# EAGLE design StmPulse-V1-G498043 (EAGLE 9.5.2)

## Sheet 1 of 6: Processor
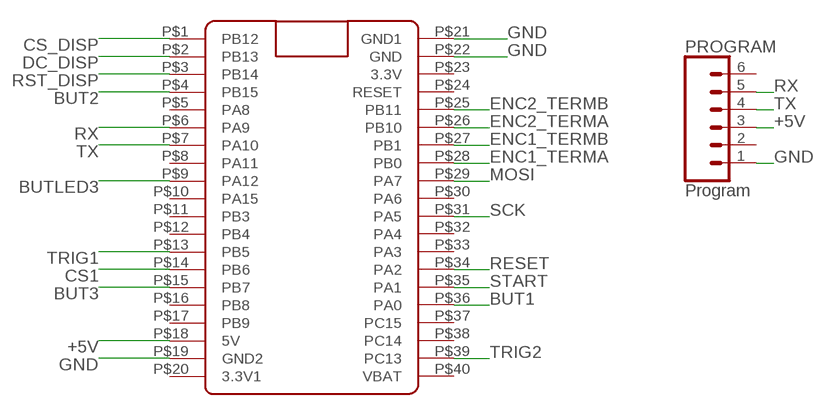
[diagram p0: schematic, sheet 1]

### Parts
PROGRAM  Program  CONN_06SILK_FEMALE_PTH  [1X06]
U$1  Blue Pill  BLUE_PILL  [BLUE_PILL]

### Nets
+5V: PROGRAM.3 U$1.P$18(5V) ; also sheet 2,3,4,5,6
BUT1 [Power]: U$1.P$36(PA0) ; also sheet 2
BUT2 [Power]: U$1.P$4(PB15) ; also sheet 2
BUT3: U$1.P$15(PB7) ; also sheet 2
BUTLED3: U$1.P$9(PA12) ; also sheet 2
CS1: U$1.P$14(PB6) ; also sheet 6
CS_DISP: U$1.P$1(PB12) ; also sheet 3,4
DC_DISP: U$1.P$2(PB13) ; also sheet 3,4
ENC1_TERMA: U$1.P$28(PB0) ; also sheet 2
ENC1_TERMB: U$1.P$27(PB1) ; also sheet 2
ENC2_TERMA: U$1.P$26(PB10) ; also sheet 2
ENC2_TERMB: U$1.P$25(PB11) ; also sheet 2
GND [Power]: PROGRAM.1 U$1.P$19(GND2) U$1.P$21(GND1) U$1.P$22(GND) ; also sheet 2,3,4,5,6
MOSI: U$1.P$29(PA7) ; also sheet 3,4,6
RESET: U$1.P$34(PA2) ; also sheet 2
RST_DISP: U$1.P$3(PB14) ; also sheet 3,4
RX: PROGRAM.5 U$1.P$6(PA9)
SCK: U$1.P$31(PA5) ; also sheet 3,4,6
START: U$1.P$35(PA1) ; also sheet 2
TRIG1: U$1.P$13(PB5) ; also sheet 5
TRIG2: U$1.P$39(PC13) ; also sheet 5
TX: PROGRAM.4 U$1.P$7(PA10)
Unconnected: PROGRAM.2 PROGRAM.6 U$1.P$5(PA8) U$1.P$8(PA11) U$1.P$10(PA15) U$1.P$11(PB3) U$1.P$12(PB4) U$1.P$16(PB8) U$1.P$17(PB9) U$1.P$20(3.3V1) U$1.P$23(3.3V) U$1.P$24(RESET) U$1.P$30(PA6) U$1.P$32(PA4) U$1.P$33(PA3) U$1.P$37(PC15) U$1.P$38(PC14) U$1.P$40(VBAT)

## Sheet 2 of 6: IO
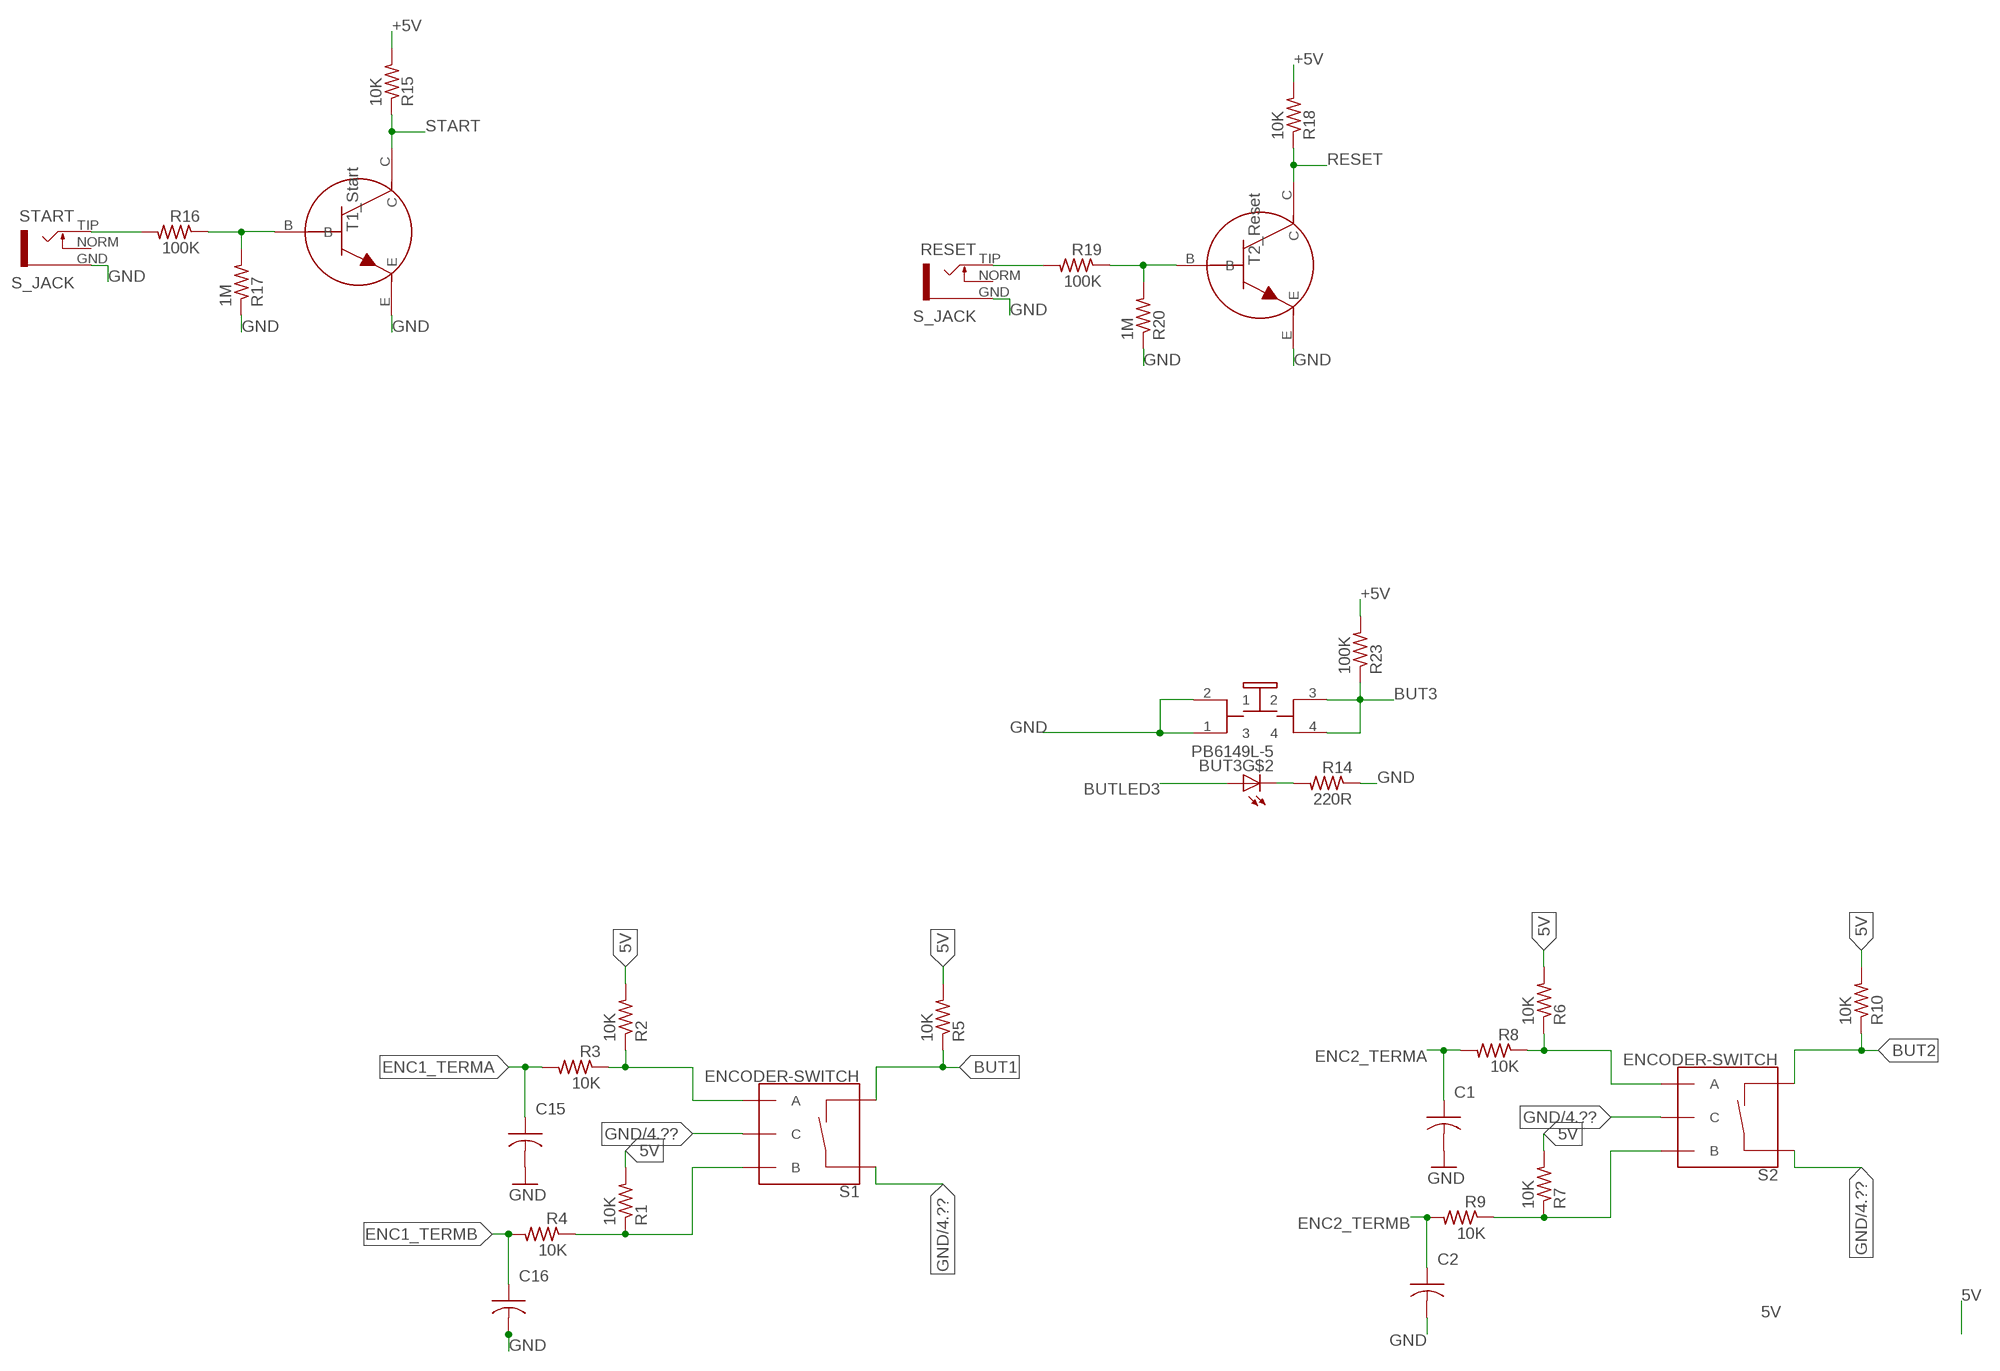
[diagram p1: schematic, sheet 2]

### Parts
BUT3  PB6149L-5  [PB6149L]
C1  10nF  C-USC0805  [C0805]
C2  10nF  C-USC0805  [C0805]
C15  10nF  C-USC0805  [C0805]
C16  10nF  C-USC0805  [C0805]
R1  10K  R-US_R0805  [R0805]
R2  10K  R-US_R0805  [R0805]
R3  10K  R-US_R0805  [R0805]
R4  10K  R-US_R0805  [R0805]
R5  10K  R-US_R0805  [R0805]
R6  10K  R-US_R0805  [R0805]
R7  10K  R-US_R0805  [R0805]
R8  10K  R-US_R0805  [R0805]
R9  10K  R-US_R0805  [R0805]
R10  10K  R-US_R0805  [R0805]
R14  220R  R-US_R0805  [R0805]
R15  10K  R-US_R0805  [R0805]
R16  100K  R-US_R0805  [R0805]
R17  1M  R-US_R0805  [R0805]
R18  10K  R-US_R0805  [R0805]
R19  100K  R-US_R0805  [R0805]
R20  1M  R-US_R0805  [R0805]
R23  100K  R-US_R0805  [R0805]
RESET  S_JACK  [S_JACK]
S1  ENCODER-SWITCH  [ROTARY_ENC_PLAIN]
S2  ENCODER-SWITCH  [ROTARY_ENC_PLAIN]
START  S_JACK  [S_JACK]
T1_CLOCK  2N3904  TRANSISTOR_MMBT3904  [TRANSISTOR_SINGLE_N-TYPE]
T2_RESET  TRANSISTOR_MMBT3904  [TRANSISTOR_SINGLE_N-TYPE]

### Nets
5V: R1.2 R2.2 R5.2 R6.2 R7.2 R10.2
+5V: R15.2 R18.2 R23.2 ; also sheet 1,3,4,5,6
BUT1 [Power]: R5.1 S1.SW- ; also sheet 1
BUT2 [Power]: R10.1 S2.SW- ; also sheet 1
BUT3: BUT3.3 BUT3.4 R23.1 ; also sheet 1
BUTLED3: BUT3.A ; also sheet 1
ENC1_TERMA: C15.1 R3.2 ; also sheet 1
ENC1_TERMB: C16.1 R4.2 ; also sheet 1
ENC2_TERMA: C1.1 R8.2 ; also sheet 1
ENC2_TERMB: C2.1 R9.2 ; also sheet 1
GND [Power]: BUT3.1 BUT3.2 C1.2 C2.2 C15.2 C16.2 R14.1 R17.1 R20.1 RESET.GND S1.C S1.SW+ S2.C S2.SW+ START.GND T1_CLOCK.E T2_RESET.E ; also sheet 1,3,4,5,6
N$1: R6.1 R8.1 S2.A
N$2: R7.1 R9.1 S2.B
N$6: R2.1 R3.1 S1.A
N$12: R1.1 R4.1 S1.B
N$15: BUT3.K(C) R14.2
N$16: R19.1 R20.2 T2_RESET.B
N$17: R16.1 R17.2 T1_CLOCK.B
N$18: R19.2 RESET.TIP
N$26: R16.2 START.TIP
RESET: R18.1 T2_RESET.C ; also sheet 1
START: R15.1 T1_CLOCK.C ; also sheet 1
Unconnected: RESET.NORM START.NORM

## Sheet 3 of 6: Power
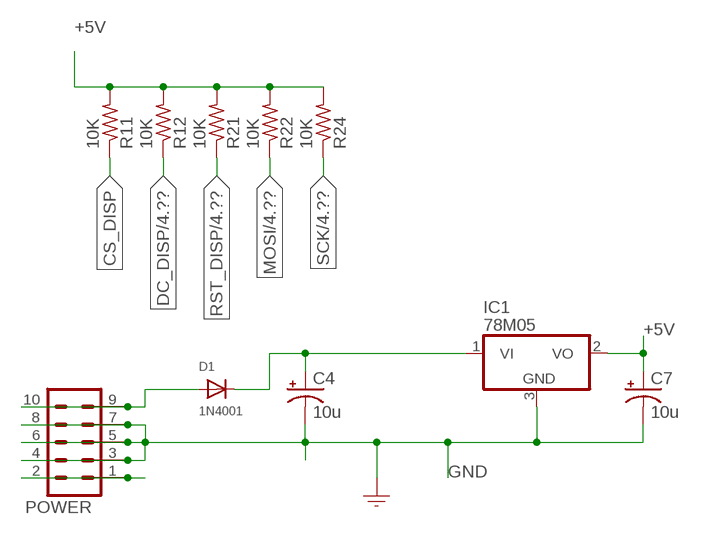
[diagram p2: schematic, sheet 3]

### Parts
C4  10u  CAPACITOR_POL-US153CLV-0505  [153CLV-0505]
C7  10u  CAPACITOR_POL-US153CLV-0505  [153CLV-0505]
D1  1N4001  DIODESMA  [SMADIODE]
IC1  78M05  VOLTAGE_REG_POS05DT  [TO252]
POWER  CONN_05X2SHD_SMD  [2X5-SHROUDED_SMD]
R11  10K  R-US_R0805  [R0805]
R12  10K  R-US_R0805  [R0805]
R21  10K  R-US_R0805  [R0805]
R22  10K  R-US_R0805  [R0805]
R24  10K  R-US_R0805  [R0805]

### Nets
+5V: C7.+ IC1.2(VO) R11.2 R12.2 R21.2 R22.2 R24.2 ; also sheet 1,2,4,5,6
+12V: C4.+ D1.C IC1.1(VI)
CS_DISP: R11.1 ; also sheet 1,4
DC_DISP: R12.1 ; also sheet 1,4
GND [Power]: C4.- C7.- IC1.3(GND) POWER.3 POWER.4 POWER.5 POWER.6 POWER.7 POWER.8 ; also sheet 1,2,4,5,6
MOSI: R22.1 ; also sheet 1,4,6
N$9: D1.A POWER.9 POWER.10
N$10: POWER.1 POWER.2
RST_DISP: R21.1 ; also sheet 1,4
SCK: R24.1 ; also sheet 1,4,6

## Sheet 4 of 6: OLED
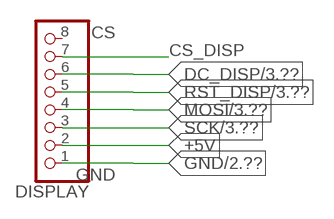
[diagram p3: schematic, sheet 4]

### Parts
DISPLAY  MICROBUILDER_HEADER-1X8ROUND  [MICROBUILDER_1X08_ROUND]

### Nets
+5V: DISPLAY.2 ; also sheet 1,2,3,5,6
CS_DISP: DISPLAY.7 ; also sheet 1,3
DC_DISP: DISPLAY.6 ; also sheet 1,3
GND [Power]: DISPLAY.1 ; also sheet 1,2,3,5,6
MOSI: DISPLAY.4 ; also sheet 1,3,6
RST_DISP: DISPLAY.5 ; also sheet 1,3
SCK: DISPLAY.3 ; also sheet 1,3,6
Unconnected: DISPLAY.8

### Notes on the sheet
- CS
- GND

## Sheet 5 of 6: Out
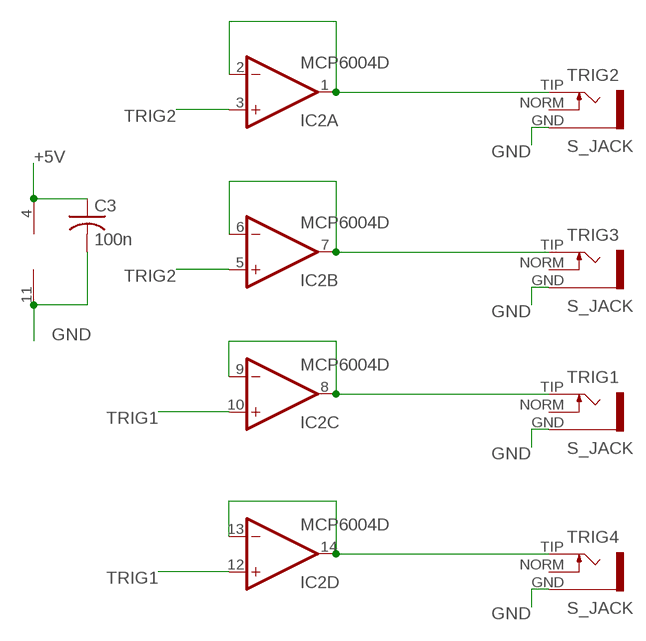
[diagram p4: schematic, sheet 5]

### Parts
C3  100n  C-USC0805K  [C0805K]
IC2  MCP6004D  [SO14]
TRIG1  S_JACK  [S_JACK]
TRIG2  S_JACK  [S_JACK]
TRIG3  S_JACK  [S_JACK]
TRIG4  S_JACK  [S_JACK]

### Nets
+5V: C3.1 IC2.4(P:V+) ; also sheet 1,2,3,4,6
GND [Power]: C3.2 IC2.11(P:V-) TRIG1.GND TRIG2.GND TRIG3.GND TRIG4.GND ; also sheet 1,2,3,4,6
N$7: IC2.1(A:OUT) IC2.2(A:-IN) TRIG2.TIP
N$8: IC2.8(C:OUT) IC2.9(C:-IN) TRIG1.TIP
N$13: IC2.6(B:-IN) IC2.7(B:OUT) TRIG3.TIP
N$14: IC2.13(D:-IN) IC2.14(D:OUT) TRIG4.TIP
TRIG1: IC2.10(C:+IN) IC2.12(D:+IN) ; also sheet 1
TRIG2: IC2.3(A:+IN) IC2.5(B:+IN) ; also sheet 1
Unconnected: TRIG1.NORM TRIG2.NORM TRIG3.NORM TRIG4.NORM

## Sheet 6 of 6: DAC
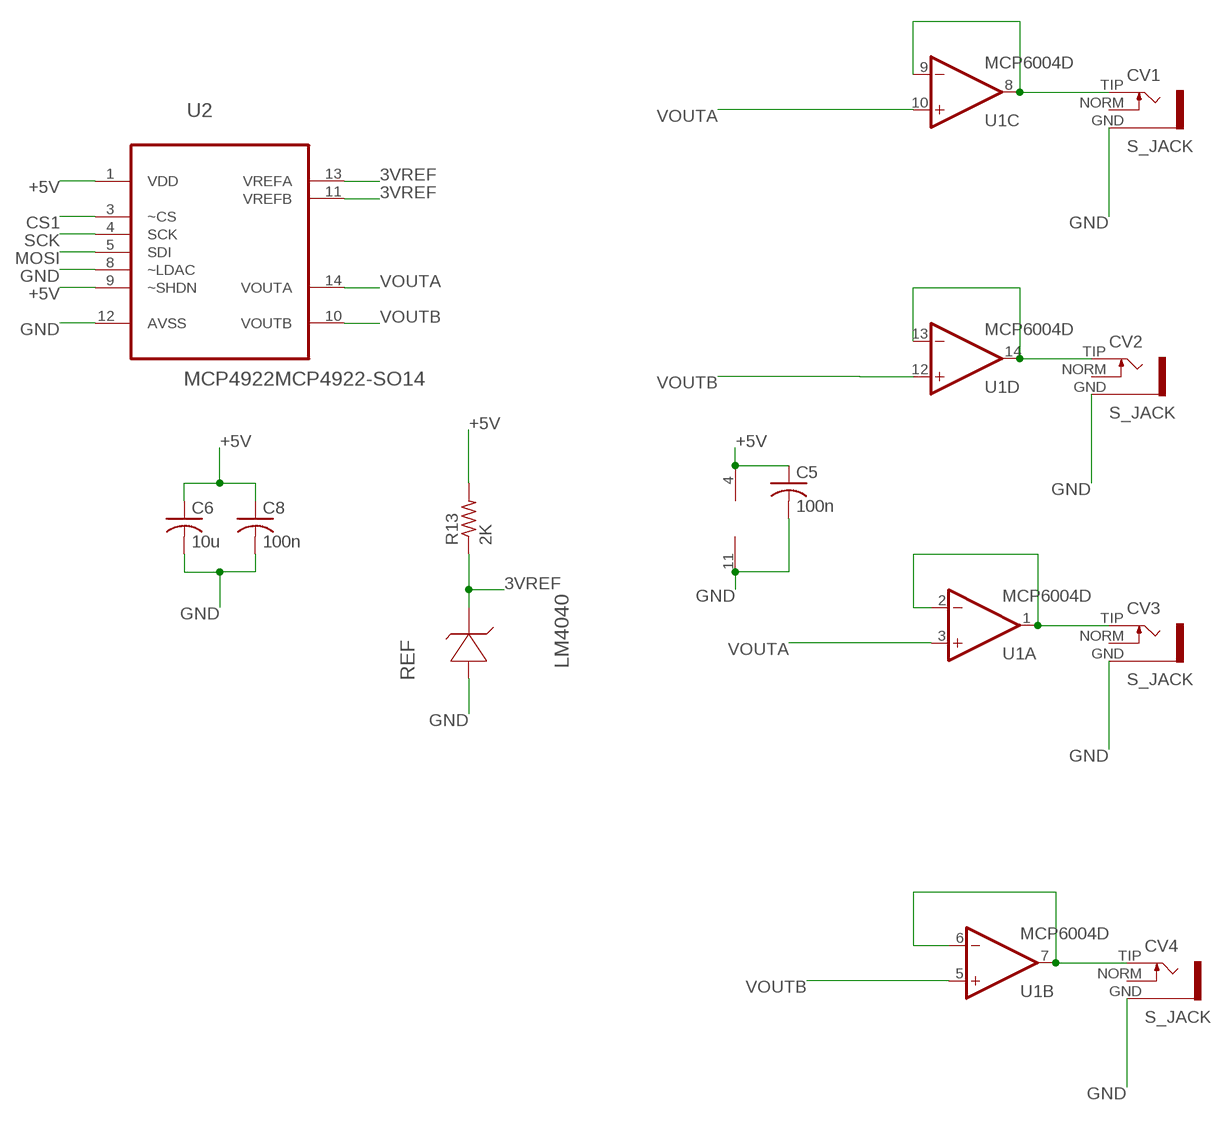
[diagram p5: schematic, sheet 6]

### Parts
C5  100n  C-USC0805K  [C0805K]
C6  10u  C-USC0805K  [C0805K]
C8  100n  C-USC0805K  [C0805K]
CV1  S_JACK  [S_JACK]
CV2  S_JACK  [S_JACK]
CV3  S_JACK  [S_JACK]
CV4  S_JACK  [S_JACK]
R13  2K  R-US_R0805  [R0805]
REF  LM4040  LM4040A30IDBZT  [SOT95P237X112-3N]
U1  MCP6004D  [SO14]
U2  MCP4922MCP4922-SO14  [SO14]

### Nets
3VREF: R13.1 REF.1(CATHODE) U2.11(VREFB) U2.13(VREFA)
+5V: C5.1 C6.1 C8.1 R13.2 U1.4(P:V+) U2.1(VDD) U2.9(~SHDN) ; also sheet 1,2,3,4,5
CS1: U2.3(~CS) ; also sheet 1
GND [Power]: C5.2 C6.2 C8.2 CV1.GND CV2.GND CV3.GND CV4.GND REF.2(ANODE) U1.11(P:V-) U2.8(~LDAC) U2.12(AVSS) ; also sheet 1,2,3,4,5
MOSI: U2.5(SDI) ; also sheet 1,3,4
N$4: CV3.TIP U1.1(A:OUT) U1.2(A:-IN)
N$5: CV4.TIP U1.6(B:-IN) U1.7(B:OUT)
N$11: CV1.TIP U1.8(C:OUT) U1.9(C:-IN)
N$36: CV2.TIP U1.13(D:-IN) U1.14(D:OUT)
SCK: U2.4(SCK) ; also sheet 1,3,4
VOUTA: U1.3(A:+IN) U1.10(C:+IN) U2.14(VOUTA)
VOUTB: U1.5(B:+IN) U1.12(D:+IN) U2.10(VOUTB)
Unconnected: CV1.NORM CV2.NORM CV3.NORM CV4.NORM REF.3(NC)

## Library data of the parts
BUT3 = INSTRUO:PB6149L-5
C1-C3 C5 C6 C8 C15 C16 = rcl:C-US: CAPACITOR, American symbol
C4 C7 = GMSN:CAPACITOR_POL-US: POLARIZED CAPACITOR, American symbol
CV1-CV4 RESET START TRIG1-TRIG4 = INSTRUO:S_JACK
D1 = GMSN:DIODE: Diode SMADIODE - SMA Surface Mount Package 20V 1A Schottky Diode Digikey: 641-1014-6-ND DO-1N4148 - Through Hole Small Current Diode SOD-123 20V 1 A (.5mV Vf) Schottky Diode - Digikey: MBRX120TPMSCT-ND SOD-323 10V 570mA (.38mV Vf, 3ns) Schottky Diode - Digikey: ZLLS410CT-ND SOD-523 30V 30mA Schottky Diode (RB751S-40TE61) - Digikey: RB751S-40TE61CT-ND SOT23-R/W - SOT23 Package (R = Solder Paste/Reflow Ovens, W = Hand-Soldering) BAT54Film 40V 300mA - Digikey: 497-7162-1-ND
DISPLAY = Adafruit_1.3_128x64_OLED:MICROBUILDER_HEADER-1X8: PIN HEADER
IC1 = GMSN:VOLTAGE_REG_POS: Positive VOLTAGE REGULATOR Added bigger pads to the TO-92 package
IC2 = GMSN-R2Project:MCP6004: OP AMP
POWER = SparkFun-Connectors:CONN_05X2: Multi connection point. Often used as Generic Header-pin footprint for 0.1 inch spaced/style header connections For AVR SPI programming port, see special device with nice symbol: "AVR_SPI_PROG_5x2.dev" You can populate with any combo of single row headers, but if you'd like an exact match, check these: 2x5 AVR ICSP Male Header <https://www.sparkfun.com/products/778> (PRT-00778) 2x5 Pin Shrouded Header <https://www.sparkfun.com/products/8506> (PRT-08506) On any of the 0.1 inch spaced packages, you can populate with these: Break Away Headers - Straight <https://www.sparkfun.com/products/116> (PRT-00116) Break Away Male Headers - Right Angle <https://www.sparkfun.com/products/553> (PRT-00553) Female Headers <https://www.sparkfun.com/products/115> (PRT-00115) Break Away Headers - Machine Pin <https://www.sparkfun.com/products/117> (PRT-00117) Break Away Female Headers - Swiss Machine Pin <https://www.sparkfun.com/products/743> (PRT-00743) Special note: the shrouded connector mates well with our 5x2 ribbon cables: 2x5 Pin IDC Ribbon Cable <https://www.sparkfun.com/products/8535> (PRT-08535); PROD_ID: CONN-09508; RS-PART: 828-1783
PROGRAM = SparkFun-Connectors:CONN_06: Multi connection point. Often used as Generic Header-pin footprint for 0.1 inch spaced/style header connections On any of the 0.1 inch spaced packages, you can populate with these: Break Away Headers - Straight <https://www.sparkfun.com/products/116> (PRT-00116) Break Away Male Headers - Right Angle <https://www.sparkfun.com/products/553> (PRT-00553) Female Headers <https://www.sparkfun.com/products/115> (PRT-00115) Break Away Headers - Machine Pin <https://www.sparkfun.com/products/117> (PRT-00117) Break Away Female Headers - Swiss Machine Pin <https://www.sparkfun.com/products/743> (PRT-00743) Arduino Stackable Header - 6 Pin <https://www.sparkfun.com/products/9280> (PRT-09280) For SCREWTERMINALS and SPRING TERMINALS visit here: Screw Terimnals on SparkFun.com <https://www.sparkfun.com/search/results?term=Screw+Terminals> (5mm/3.5mm/2.54mm spacing) This device is also useful as a general connection point to wire up your design to another part of your project. Our various solder wires solder well into these plated through hole pads. Hook-Up Wire - Assortment (Stranded, 22 AWG) <https://www.sparkfun.com/products/11375> (PRT-11375) Hook-Up Wire - Assortment (Solid Core, 22 AWG) <https://www.sparkfun.com/products/11367> (PRT-11367) View the entire wire category on our website here <https://www.sparkfun.com/categories/141>; PROD_ID: CONN-08437
R1-R24 = rcl:R-US_: RESISTOR, American symbol
REF = GMSN-R2Project:LM4040A30IDBZT: PRECISION MICROPOWER SHUNT VOLTAGE REFERENCE; MPN: LM4040A30IDBZT; OC_FARNELL: 1755108; OC_NEWARK: 58K5870; PACKAGE: 3-SOT-23; RS-PART: 809-6343; SUPPLIER: TEXAS INSTRUMENTS
S1 S2 = SparkFun-Switches:ENCODER-SWITCH: Rotary Encoder w/ Select Switch Encoders rotate similarly to potentiometers, but they’re different from potentiometers in that an encoder has full rotation without limits. They output gray code so that you can tell how much and in which direction the encoder has been turned. This encoder includes a push-down select switch built into the shaft. SparkFun Products Rotary Encoder <https://www.sparkfun.com/products/9117> (COM-09117); SF_SKU: COM-09117
T1_CLOCK = INSTRUO:TRANSISTOR_MMBT3904; LABLEL: T1_Start; RS-PART: 725-8616
T2_RESET = INSTRUO:TRANSISTOR_MMBT3904; LABEL: T2_Reset; RS-PART: 725-8616
U1 = GMSN-R2Project:MCP6004: OP AMP; RS-PART: 628-3481 (10)
U2 = GMSN-R2Project:MCP4922; RS-PART: 402-910
U$1 = BluePill:BLUE_PILL

## Net classes
1 Power: width 0.61 mm

## Board
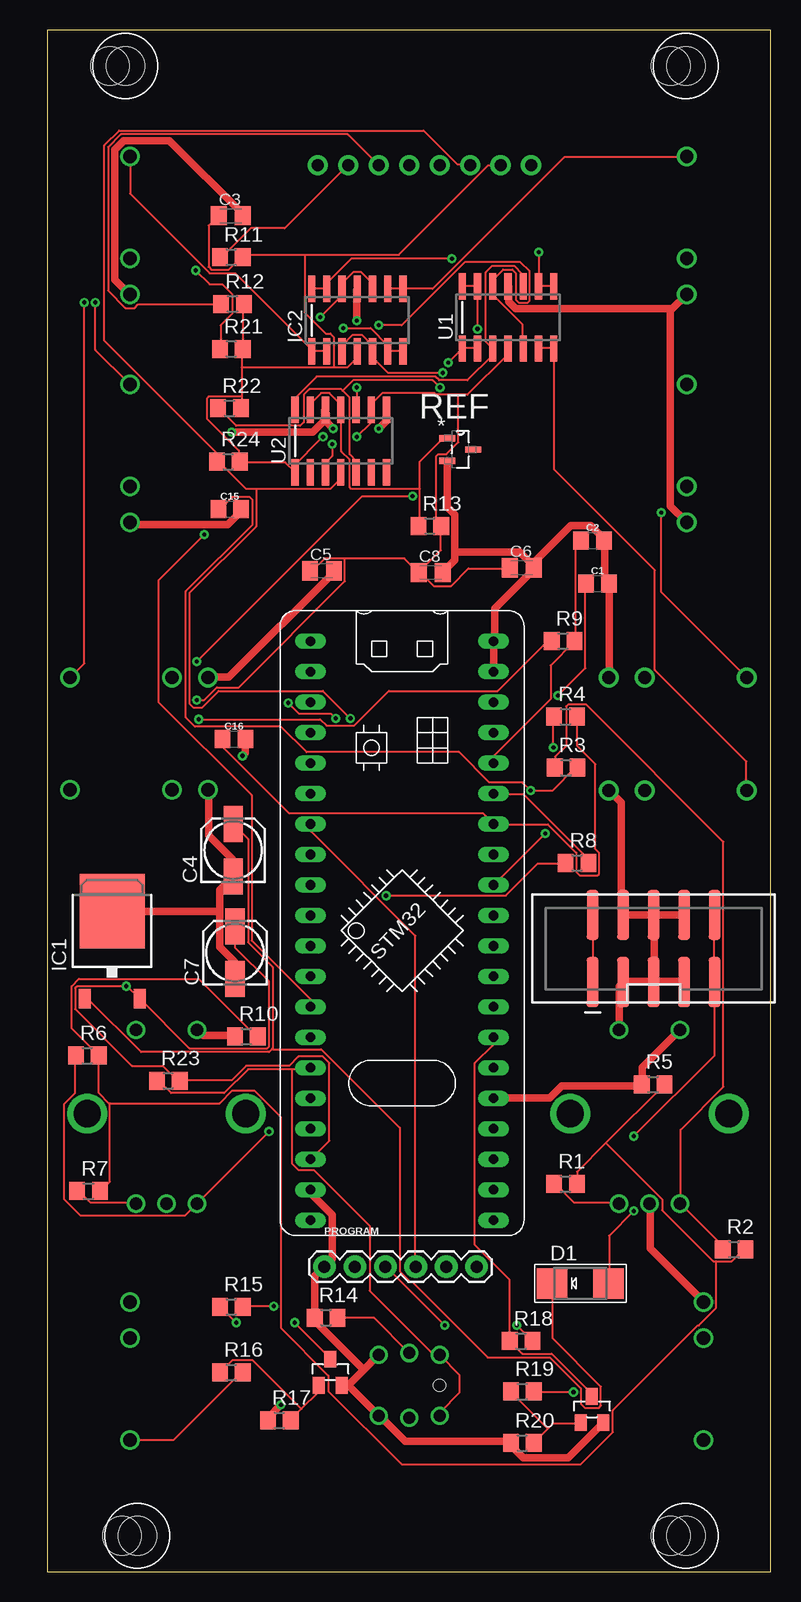
[diagram p6: board, top side]
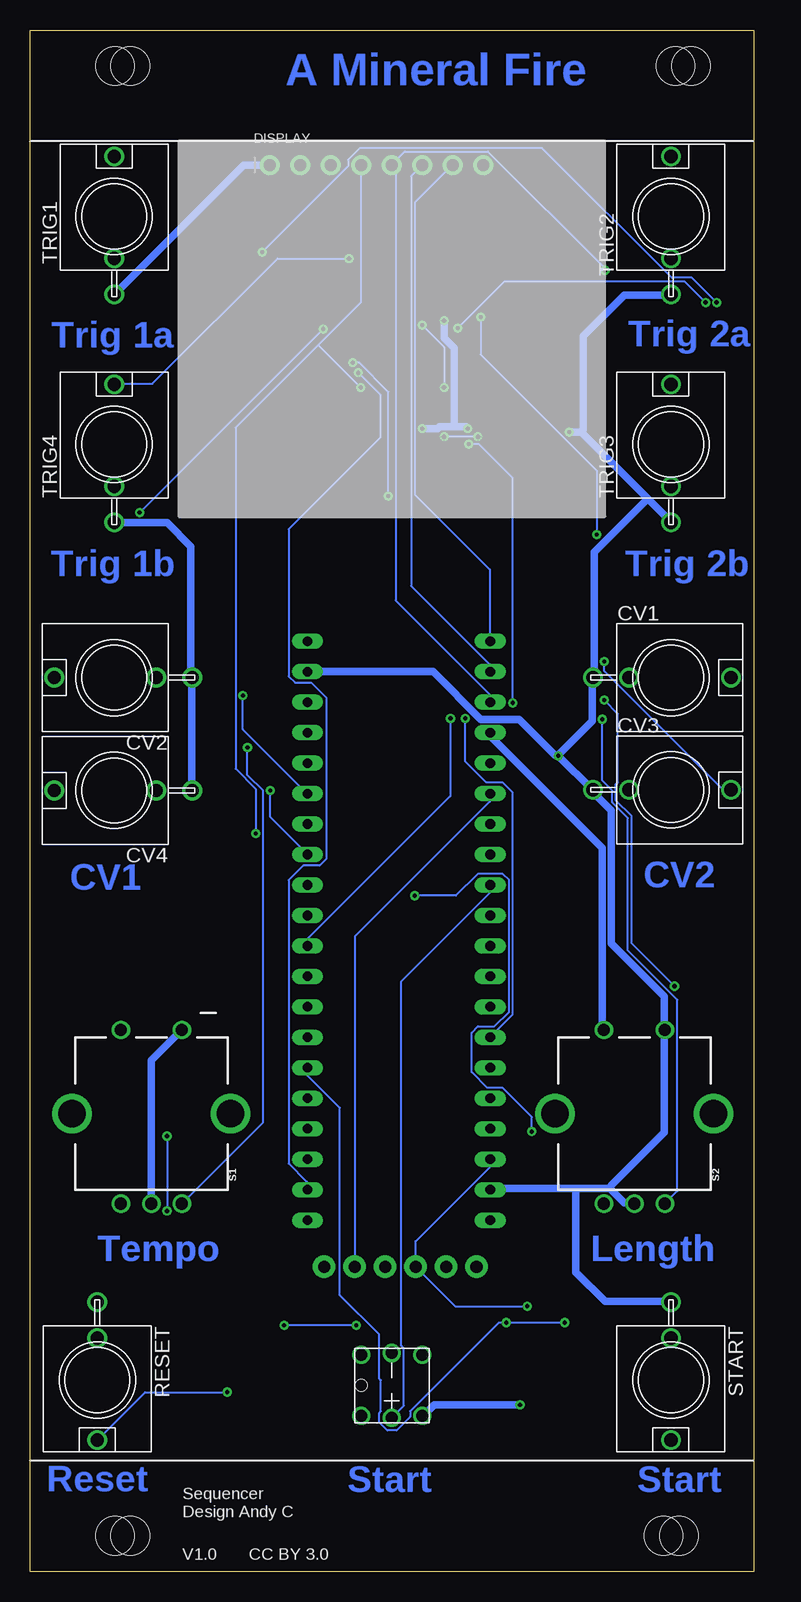
[diagram p7: board, bottom side, seen from below]

Size 60.3 x 128.52 mm. Coordinates in mm from the lower left corner, seen from the top.
Outline: 60.3,0.02 60.3,128.52 0,128.52 0,0 60.3,0.02
Copper layers (1*16): Top 0.035mm / dielectric 1.5mm / Bottom 0.035mm
Design rules "default": minimum track width 6mil, minimum drill 0.35mm, track to track 6mil, track to pad 6mil, pad to pad 6mil, via to via 6mil, smd to smd 6mil, copper to edge 40mil, drill to drill 6mil, minimum pad ring 10mil, minimum via ring 8mil, stop-mask expansion 4mil, vias tented up to drill 0mil, thermal gap 10mil

### Footprints (pad centres in the part's own frame; a part is rotated, then mirrored left to right if it is on the bottom)
PB6149L = drill 1: 1 2.54,-2.54; 2 2.54,2.54; 3 -2.54,-2.54; 4 -2.54,2.54; A 0,-2.7; K 0,2.7 | hole 1: -2.54,0
C0805 = smd 1.3 x 1.5: 1 -0.95,0; 2 0.95,0
C0805K = smd 1.3 x 1.6: 1 -1,0; 2 1,0
153CLV-0505 = smd 3 x 1.6: + 2.2,0; - -2.2,0
S_JACK = drill 1.1: GND 0,-6.5; NORM 0,-3.5; TIP 0,5
SMADIODE = smd 2.54 x 2.54: A 2.349,0; C -2.349,0
MICROBUILDER_1X08_ROUND = drill 1 pad 1.676: 1 -8.89,0; 2 -6.35,0; 3 -3.81,0; 4 -1.27,0; 5 1.27,0; 6 3.81,0; 7 6.35,0; 8 8.89,0
TO252 = smd 1 x 1.6: 1 -2.28,-4.8; 2 2.28,-4.8 | smd 5.4 x 6.2: 3 0,2.5
SO14 = smd 0.6 x 2.2: 1 -3.81,-2.6; 2 -2.54,-2.6; 3 -1.27,-2.6; 4 0,-2.6; 5 1.27,-2.6; 6 2.54,-2.6; 7 3.81,-2.6; 8 3.81,2.6; 9 2.54,2.6; 10 1.27,2.6; 11 0,2.6; 12 -1.27,2.6; 13 -2.54,2.6; 14 -3.81,2.6
2X5-SHROUDED_SMD = smd 4.15 x 1: 1 -2.794,5.08; 2 2.794,5.08; 3 -2.794,2.54; 4 2.794,2.54; 5 -2.794,0; 6 2.794,0; 7 -2.794,-2.54; 8 2.794,-2.54; 9 -2.794,-5.08; 10 2.794,-5.08
1X06 = drill 1.016 pad 1.88: 1 0,0; 2 2.54,0; 3 5.08,0; 4 7.62,0; 5 10.16,0; 6 12.7,0
R0805 = smd 1.3 x 1.5: 1 -0.95,0; 2 0.95,0
SOT95P237X112-3N = smd 1.321 x 0.559: 1 -1.092,0.94; 2 -1.092,-0.94 | smd 1.321 x 0.508: 3 1.092,0
ROTARY_ENC_PLAIN = drill 1.016: A 7.493,-2.54; B 7.493,2.54; C 7.493,0; SW+ -6.985,2.54; SW- -6.985,-2.54 | drill 2.286: P$3 0,6.604; P$4 0,-6.604
TRANSISTOR_SINGLE_N-TYPE = smd 1 x 1.4: B -0.95,-1.1; C 0,1.1; E 0.95,-1.1
BLUE_PILL = drill 0.8 long: P$1 -7.62,15.24; P$2 -7.62,12.7; P$3 -7.62,10.16; P$4 -7.62,7.62; P$5 -7.62,5.08; P$6 -7.62,2.54; P$7 -7.62,0; P$8 -7.62,-2.54; P$9 -7.62,-5.08; P$10 -7.62,-7.62; P$11 -7.62,-10.16; P$12 -7.62,-12.7; P$13 -7.62,-15.24; P$14 -7.62,-17.78; P$15 -7.62,-20.32; P$16 -7.62,-22.86; P$17 -7.62,-25.4; P$18 -7.62,-27.94; P$19 -7.62,-30.48; P$20 -7.62,-33.02; P$21 7.62,15.24; P$22 7.62,12.7; P$23 7.62,10.16; P$24 7.62,7.62; P$25 7.62,5.08; P$26 7.62,2.54; P$27 7.62,0; P$28 7.62,-2.54; P$29 7.62,-5.08; P$30 7.62,-7.62; P$31 7.62,-10.16; P$32 7.62,-12.7; P$33 7.62,-15.24; P$34 7.62,-17.78; P$35 7.62,-20.32; P$36 7.62,-22.86; P$37 7.62,-25.4; P$38 7.62,-27.94; P$39 7.62,-30.48; P$40 7.62,-33.02
MOUNTING_HOLE = hole 3.2: 0,0; 0,1.27

### Placement (x,y rotation side)
BUT3  30.15,15.53 0 bottom
C1  45.85,82.37 0 top
C2  45.43,85.97 0 top
C3  15.28,113.03 0 top
C4  15.48,60.15 90 top
C5  22.88,83.44 0 top
C6  39.53,83.69 0 top
C7  15.63,51.61 90 top
C8  31.95,83.29 0 top
C15  15.2,88.57 0 top
C16  15.55,69.41 0 top
CV1  6.88,74.53 270 bottom
CV2  53.28,74.53 90 bottom
CV3  6.88,65.18 270 bottom
CV4  53.28,65.13 90 bottom
D1  44.41,24.04 0 top
DISPLAY  31.42,117.26 0 bottom
IC1  5.4,52.57 0 top
IC2  25.83,104.33 0 top
POWER  50.52,51.95 90 top
PROGRAM  23.08,25.42 0 top
R1  43.18,32.33 0 top
R2  57.23,26.88 0 top
R3  43.23,67.03 0 top
R4  43.18,71.28 0 top
R5  50.48,40.63 0 top
R6  3.33,43.03 0 top
R7  3.43,31.73 0 top
R8  44.13,59.08 0 top
R9  42.98,77.58 0 top
R10  16.58,44.63 0 top
R11  15.33,109.58 0 top
R12  15.43,105.68 0 top
R13  31.88,87.16 0 top
R14  23.23,21.18 0 top
R15  15.33,22.08 0 top
R16  15.33,16.63 0 top
R17  19.33,12.63 0 top
R18  39.48,19.23 0 top
R19  39.58,15.03 0 top
R20  39.58,10.73 0 top
R21  15.33,101.93 0 top
R22  15.18,96.98 0 top
R23  10.08,40.93 0 top
R24  15.08,92.53 0 top
REF  34.41,93.55 0 top
RESET  54.68,15.98 180 bottom
S1  50.18,38.18 270 bottom
S2  9.93,38.18 270 bottom
START  6.88,15.98 180 bottom
T1_CLOCK  23.58,16.63 0 top
T2_RESET  45.38,13.53 0 top
TRIG1  53.28,112.98 0 bottom
TRIG2  6.88,112.98 0 bottom
TRIG3  6.88,93.98 0 bottom
TRIG4  53.28,93.98 0 bottom
U1  38.38,104.56 0 top
U2  24.45,94.26 0 top
U$1  29.56,62.33 0 top
U$2  [MOUNTING_HOLE]  7.5,3 90 top
U$3  [MOUNTING_HOLE]  53.22,3 90 top
U$4  [MOUNTING_HOLE]  53.22,125.52 90 top
U$5  [MOUNTING_HOLE]  6.5,125.52 90 top

### Tracks (layer width: path | path; a pad name or v marks a point on that pad's centre or on a via)
3VREF
  Top 0.152: U2.13 21.98,96.89 21.98,97.43 22.82,98.27 23.51,98.27 24.42,97.35 24.42,96.89 U2.11 24.5,96.82 24.5,93.39 25.18,92.7 25.18,90.42 25.34,90.26 31.05,90.26 | 31.05,90.26 31.05,87.29 30.97,87.22 R13.1 | 31.05,90.26 31.05,92.55 32.96,94.45 33.26,94.45 REF.1
5V
  Top 0.152: 46.56,35.74 51.4,40.58 R5.2 | 46.56,35.74 44.16,33.34 44.16,32.35 R1.2 | 55.74,25.88 55.51,25.88 51.24,30.14 51.24,31.06 46.56,35.74 | 55.74,25.88 57.03,25.88 58.03,26.87 58.18,26.87 R2.2 | 5.18,39.02 5.22,38.98 5.22,32.5 4.46,31.74 R7.2 | 5.18,39.02 4.3,39.89 4.3,43.02 R6.2 4.23,43.1 2.02,45.31 2.02,48.81 2.63,49.42 12.61,49.42 17.33,44.7 17.49,44.7 R10.2 | 55.74,25.88 55.74,21.99 54.29,20.54 54.22,20.54 47.13,13.45 47.13,11.62 44.46,8.96 29.53,8.96 23.43,15.05 23.43,16.35 19.47,20.31 19.47,37.91 17.26,40.12 15.43,40.12 14.36,39.06 5.22,39.06 5.18,39.02
+5V  (via drill 0.35)
  Top 0.152: 34.25,98.11 35.01,98.11 38.37,101.47 38.37,101.92 U1.4 | 34.25,98.11 32.42,98.11 32.27,98.27 27.93,98.27 27.01,97.35 27.01,96.89 U2.9 26.94,96.82 26.94,95.75 v25.79,94.61 | C8.1 30.97,83.33 32.8,85.16 32.8,87.14 R13.2 32.8,87.22 32.42,87.6 32.42,93.01 32.57,93.16 33.26,93.16 34.25,94.15 34.25,98.11 | 24.8,84.47 29.76,84.47 30.9,83.33 C8.1 | 24.8,84.47 23.13,84.47 22.14,83.48 21.91,83.48 C5.1 | C6.1 38.52,83.63 35.09,83.63 33.64,82.19 32.19,82.19 31.05,83.33 C8.1 | 16.19,100.4 16.19,101.85 16.27,101.92 R21.2 16.34,102 16.34,105.66 R12.2 | 16.19,100.4 16.19,97.96 | 16.19,97.96 16.19,97.05 R22.2 | 16.19,100.4 23.89,100.4 | 23.89,100.4 25.03,100.4 25.79,101.16 25.79,101.69 IC2.4 | 16.19,97.96 13.45,97.96 13.3,97.81 13.3,96.13 15.96,93.46 15.96,92.55 R24.2 16.04,92.47 19.85,92.47 20.61,91.71 U2.1 20.38,92.02 v22.97,94.61 | C3.1 14.21,112.97 13.45,112.21 13.45,108.78 13.68,108.55 15.12,108.55 16.12,109.54 16.27,109.54 R11.2 16.34,109.62 16.5,109.77 21.45,109.77 | 21.45,109.77 29.3,109.77 36.77,117.24 37.76,117.24 DISPLAY.2 | 23.89,100.4 23.89,102.91 23.58,103.22 23.2,103.22 21.45,104.97 21.45,109.77 | C7.+ 15.66,53.76 15.66,52.01 18.48,49.19 18.48,43.78 18.33,43.63 11.85,43.63 7.73,47.74 IC1.2 7.66,47.82 6.67,48.81 v6.59,48.81 2.48,48.81 2.32,48.66 2.32,46.91 7.05,42.18 9.64,42.18 10.86,40.96 11.01,40.96 R23.2 11.09,40.96 15.35,40.96 16.57,42.18 20.15,42.18 20.92,42.94 22.97,42.94 23.51,42.41 23.51,35.93 21.98,34.41 U$1.P$18 | v39.13,20.54 40.42,19.25 R18.2 | v33.11,20.54 28.23,25.42 PROGRAM.3 | v18.86,22.14 16.34,22.14 R15.2 | 24.8,84.47 24.8,82.57 15.96,73.73 14.13,73.73 13.07,72.66 v12.46,72.66
  Bottom 0.152: v22.97,94.61 v25.79,94.61 | v33.11,20.54 v39.13,20.54 | v18.86,22.14 24.88,22.14 PROGRAM.3 28.15,25.49 28.15,27.55 21.98,33.72 21.98,34.33 U$1.P$18 | v12.46,72.66 11.31,71.52 11.31,65.8 11.47,65.65 11.47,64.28 10.17,62.98 10.17,52.39 v6.59,48.81
+12V
  Top 0.152: 18.74,43.59 18.78,43.63 18.78,50.41 16.72,52.47 16.72,61.08 15.51,62.3 C4.+ | 18.74,43.59 18.48,43.32 7.81,43.32 3.39,47.74 3.16,47.74 IC1.1 | D1.C 42.1,23.97 42.1,19.47 46.14,15.44 46.14,13.84 45.99,13.68 44.77,13.68 44.46,13.99 44.46,15.28 41.87,17.87 36.69,17.87 30.36,24.2 30.21,24.2 29.38,25.04 29.38,37 22.82,43.55 18.78,43.55 18.74,43.59
BUT1
  Top 0.61: S1.SW- 52.69,45.15 49.57,42.03 49.57,40.66 R5.1 49.26,40.51 42.86,40.51 41.87,39.51 37.22,39.51 U$1.P$36
BUT2
  Top 0.61: R10.1 15.58,44.7 12.99,44.7 12.53,45.15 S2.SW-
  Bottom 0.61: U$1.P$4 21.91,69.92 21.91,69.61 12.61,60.32 12.61,45.31 12.53,45.23 S2.SW-
BUT3
  Top 0.152: BUT3.3 32.73,13 32.73,13.3 34.33,14.9 34.33,16.43 32.73,18.03 BUT3.4 32.65,18.1 32.19,18.1 26.86,23.44 26.86,28.85 22.21,33.49 20.92,33.49 20.38,34.03 20.38,41.88 | 20.38,41.88 21.83,41.88 21.91,41.95 U$1.P$15 | 20.38,41.88 16.72,41.88 14.74,39.89 10.32,39.89 9.33,40.89 9.18,40.89 R23.1
BUTLED3
  Bottom 0.152: U$1.P$9 21.98,57.19 21.98,56.58 29.38,49.19 29.38,18.86 29.15,18.64 29.15,13.84 30.14,12.84 BUT3.A
CS1  (via drill 0.35)
  Top 0.152: v23.74,94 23.74,93.01 23.2,92.47 23.2,91.71 U2.3 | v20.08,72.43 20.99,71.52 23.66,71.52 v24.04,71.14
  Bottom 0.152: v23.74,94 22.9,94 20.08,91.18 v20.08,72.43 | v24.04,71.14 24.04,67.56 22.29,65.8 20.92,65.8 20.08,64.97 20.08,46.45 21.91,44.62 U$1.P$14
CS_DISP
  Top 0.152: R11.1 14.44,109.62 14.59,109.62 16.95,111.98 19.77,111.98 25.03,117.24 DISPLAY.7
  Bottom 0.152: U$1.P$1 21.98,77.61 21.98,83.56 28.23,89.81 28.23,114.11 25.11,117.24 DISPLAY.7
DC_DISP
  Top 0.152: R12.1 14.44,105.66 7.58,105.66 7.28,105.35 6.52,105.35 5.07,106.8 5.07,118.76 6.13,119.83 25.03,119.83 27.55,117.31 DISPLAY.6
  Bottom 0.152: U$1.P$2 21.98,75.1 21.98,75.63 28.54,82.19 28.54,116.32 27.62,117.24 DISPLAY.6
ENC1_TERMA  (via drill 0.35)
  Top 0.152: R3.2 44.16,67.02 44,67.02 42.1,65.12 v40.27,65.12 39.58,65.8 36.84,65.8 34.33,68.32 21.6,68.32 19.47,70.45 12.31,70.45 11.54,71.21 11.54,81.73 17.11,87.29 17.11,89.35 16.88,89.58 15.43,89.58 14.44,88.59 14.29,88.59 C15.1
  Bottom 0.152: v40.27,65.12 40.27,62.91 37.22,59.86 U$1.P$28
ENC1_TERMB
  Top 0.152: C16.1 14.67,69.39 14.67,68.7 20.15,63.21 36.31,63.21 37.15,62.37 U$1.P$27 37.22,62.3 41.72,62.3 44.08,59.94 44.08,58.34 44.39,58.03 45.83,58.03 45.99,58.18 45.99,59.94 45.68,60.24 45.68,67.33 44.16,68.85 44.16,71.21 R4.2
ENC2_TERMA  (via drill 0.35)
  Top 0.152: R8.2 45.07,59.1 45.07,59.4 39.66,64.81 37.22,64.81 U$1.P$26 | v42.56,73.04 44.84,75.33 44.84,82.34 C1.1
  Bottom 0.152: v42.56,73.04 42.56,70.22 37.22,64.89 U$1.P$26
ENC2_TERMB
  Top 0.152: C2.1 44.46,85.92 44,85.46 44,77.61 R9.2 43.93,77.54 41.95,75.56 41.95,72.74 37.22,68.01 37.22,67.48 U$1.P$25
GND  (via drill 0.35)
  Top 0.61: S1.C 50.25,30.68 50.25,26.94 54.67,22.52 RESET.GND | POWER.6 50.48,54.75 48.04,54.75 POWER.4 47.81,54.98 47.81,64.13 46.82,65.12 CV4.GND | POWER.8 53,54.75 50.79,54.75 POWER.6 | S1.SW+ 47.66,45.23 47.66,48.81 47.97,49.12 POWER.3 48.27,49.19 50.48,49.19 POWER.5 | POWER.7 53,49.19 50.79,49.19 POWER.5 | POWER.6 50.56,54.45 50.56,49.5 POWER.5 | 51.93,105.28 52.08,105.28 53.22,106.42 TRIG1.GND | 51.93,105.28 39.05,105.28 38.44,105.89 38.44,107.1 U1.11 | U$1.P$22 37.22,75.1 37.22,77.54 U$1.P$21 37.3,77.84 37.3,80.28 40.42,83.41 C6.2 | 33.95,85.01 33.95,84.32 32.96,83.33 C8.2 | 33.95,85.01 33.95,88.13 33.34,88.74 33.34,92.55 REF.2 | 33.95,85.01 39.36,85.01 40.5,83.86 40.5,83.71 C6.2 | CV2.GND 46.82,74.57 46.82,82.11 C1.2 46.75,82.42 46.44,82.72 46.44,85.92 C2.2 46.29,86.22 45.3,87.22 43.62,87.22 40.58,84.17 C6.2 | 51.93,105.28 51.93,88.82 53.22,87.52 TRIG4.GND | T2_RESET.E 46.29,12.39 43.39,9.49 39.66,9.49 38.67,10.48 38.67,10.71 R20.1 38.37,10.86 29.83,10.86 27.85,12.84 BUT3.1 27.62,13 25.26,15.36 25.11,15.59 | 25.11,15.59 24.57,15.59 T1_CLOCK.E | 26.36,16.84 27.55,18.03 BUT3.2 | 26.36,16.84 25.11,15.59 | v19.47,13.91 18.4,12.84 18.4,12.69 R17.1 | U$1.P$19 21.98,31.82 21.98,31.51 23.74,29.76 23.74,26.1 23.28,25.65 PROGRAM.1 23.05,25.42 22.29,24.66 22.29,21.23 R14.1 22.29,20.92 26.36,16.84 | C3.2 16.27,113.05 16.27,113.2 10.17,119.3 6.36,119.3 5.6,118.53 5.6,107.71 6.82,106.49 TRIG2.GND | C15.2 16.12,88.51 16.12,88.36 15.05,87.29 7.05,87.29 6.9,87.44 TRIG3.GND | v15.35,94.99 22.14,94.99 23.13,95.98 23.13,96.82 U2.12 23.28,95.83 v23.81,95.29 | v27.62,95.29 28.23,95.9 28.23,96.82 U2.8
  Top 0.61: v25.79,104.28 25.79,106.88 IC2.11 | C5.2 23.81,83.41 23.81,83.25 15.12,74.57 13.45,74.57 CV1.GND | v16.27,68.01 16.5,68.24 16.5,69.39 C16.2 | CV3.GND 13.45,65.12 13.45,61.38 15.43,59.4 15.43,57.95 C4.- 15.28,57.73 14.36,56.81 14.36,55.06 | 14.36,55.06 14.36,52.09 15.58,50.87 15.58,49.42 C7.- | 14.36,55.06 5.45,55.06 IC1.3
  Bottom 0.61: S1.C 50.18,30.75 50.18,42.64 47.66,45.15 S1.SW+ | DISPLAY.1 40.35,117.24 42.48,117.24 53.22,106.49 TRIG1.GND | CV4.GND 46.82,65.19 46.82,74.49 CV2.GND 46.9,74.8 46.9,85.46 48.88,87.44 53.22,87.44 TRIG4.GND | v19.47,13.91 26.63,13.91 27.55,13 BUT3.1 | 12,31.97 10.78,30.75 9.94,30.75 S2.C | 14.82,31.97 21.83,31.97 21.91,31.89 U$1.P$19 | 14.82,31.97 12,31.97 | 12,31.97 11.85,32.2 7.43,36.62 7.43,45.15 S2.SW+ 7.43,45.46 7.43,47.97 11.85,52.39 11.85,63.44 13.3,64.89 CV3.GND 13.45,65.19 v16.27,68.01 | 14.82,31.97 14.82,24.96 12.38,22.52 6.9,22.52 START.GND | 14.36,94.99 v15.35,94.99 | 8.84,89.46 6.9,87.52 TRIG3.GND | 8.84,89.46 14.36,94.99 | v27.62,95.29 26.33,95.29 26.17,95.45 24.95,95.45 | 24.95,95.45 23.96,95.45 v23.81,95.29 | v25.79,104.28 25.79,102.84 24.95,102 24.95,95.45 | TRIG2.GND 6.9,106.42 10.78,106.42 14.21,102.99 14.21,95.22 14.36,94.99 | v16.27,68.01 16.12,68.24 13.45,70.91 13.45,74.49 CV1.GND 13.3,74.8 13.3,85.01 8.84,89.46 | U$1.P$22 37.15,75.02 26.71,75.02 22.74,71.06 19.54,71.06 16.57,68.09 v16.27,68.01
MOSI  (via drill 0.35)
  Top 0.152: 24.61,98.45 25.18,97.88 25.18,93.16 25.72,92.63 25.72,91.71 U2.5 | 24.61,98.45 24.5,98.57 21.83,98.57 21.37,98.11 21.37,95.83 21.07,95.52 15.73,95.52 14.29,96.97 R22.1 | v41.49,61.54 37.22,57.27 U$1.P$29 | 24.61,98.45 25.49,99.33 32.12,99.33 v32.73,98.72
  Bottom 0.152: v41.49,61.54 41.49,65.27 43.17,66.95 43.17,95.37 36.27,102.27 | 36.27,102.27 32.73,105.81 32.73,117.24 DISPLAY.4 | 36.27,102.27 v32.73,98.72
N$1  (via drill 0.35)
  Top 0.152: R6.1 2.32,43.02 2.32,39.89 1.41,38.98 1.41,31.06 2.78,29.69 11.47,29.69 12.46,30.68 S2.A 12.53,30.75 v18.48,36.7 | v28.23,56.36 38.21,56.36 40.88,59.02 43.17,59.02 R8.1
  Bottom 0.152: v28.23,56.36 24.8,56.36 22.97,58.18 20.92,58.18 20.38,57.65 20.38,46.68 21.6,45.46 22.97,45.46 23.51,44.92 23.51,41.65 22.21,40.35 20.92,40.35 18.48,37.91 v18.48,36.7
N$2  (via drill 0.35)
  Top 0.152: R7.1 2.55,31.67 2.7,31.67 3.62,30.75 7.35,30.75 S2.B | v12.61,71.06 22.74,71.06 23.28,70.53 25.56,70.53 28.46,73.42 37.53,73.42 41.64,77.54 42.02,77.54 R9.1
  Bottom 0.152: v12.61,71.06 12.61,65.96 11.77,65.12 11.77,64.13 10.48,62.83 10.48,51.78 6.36,47.67 6.36,31.74 7.35,30.75 S2.B
N$4  (via drill 0.35)
  Top 0.152: U1.2 35.77,102 34.63,102 U1.1 34.56,101.92 v33.41,100.78 | v30.44,89.65 26.25,89.65 v12.46,75.86
  Bottom 0.152: v33.41,100.78 32.88,100.78 30.44,98.34 v30.44,89.65 | v12.46,75.86 12.46,75.1 2.55,65.19 1.94,65.19 CV3.TIP
N$5
  Top 0.152: U1.6 40.96,102 42.18,102 U1.7 42.25,101.92 42.25,91.86 50.63,83.48 50.63,75.18 58.25,67.56 58.25,65.19 CV4.TIP
N$6
  Top 0.152: R2.1 56.27,26.94 56.27,27.17 52.77,30.68 S1.A 52.77,30.75 52.77,36.85 56.35,40.43 56.35,60.85 44.92,72.28 43.39,72.28 43.24,72.13 43.24,68.85 42.33,67.94 42.33,67.1 R3.1
N$7
  Top 0.152: IC2.2 23.28,101.77 22.06,101.77 IC2.1 22.06,101.85 15.66,108.25 13.52,108.25 6.9,114.88 6.9,117.92 TRIG2.TIP
N$8
  Top 0.152: IC2.9 28.38,106.95 29.6,106.95 IC2.8 29.68,106.95 32.12,106.95 43.09,117.92 53.22,117.92 TRIG1.TIP
N$9  (via drill 0.35)
  Top 0.152: v48.88,30.07 46.82,28.01 46.82,24.05 D1.A | v48.88,36.31 55.59,43.02 55.59,49.12 POWER.9 55.59,49.19 55.59,54.68 POWER.10
  Bottom 0.152: v48.88,36.31 v48.88,30.07
N$10
  Top 0.152: POWER.1 45.45,49.19 45.45,54.68 POWER.2
N$11  (via drill 0.35)
  Top 0.152: U1.8 42.18,107.18 40.96,107.18 U1.9 40.96,107.26 v40.96,110 | v3.09,105.81 3.09,75.71 1.94,74.57 CV1.TIP
  Bottom 0.152: v40.96,110 33.79,117.16 33.79,117.7 32.8,118.69 17.64,118.69 6.82,107.87 5.14,107.87 v3.09,105.81
N$12  (via drill 0.35)
  Top 0.152: R1.1 42.25,32.27 42.4,32.27 43.93,30.75 47.59,30.75 S1.B | v42.18,68.7 42.18,71.21 R4.1
  Bottom 0.152: v42.18,68.7 42.18,66.41 40.88,65.12 40.88,37.46 47.59,30.75 S1.B
N$13  (via drill 0.35)
  Top 0.152: IC2.7 29.6,101.77 28.38,101.77 IC2.6 28.38,101.85 28.38,102.23 26.94,103.67 v24.65,103.67 | v4,105.81 4,101.85 6.82,99.03 TRIG3.TIP
  Bottom 0.152: v24.65,103.67 20.76,107.56 5.75,107.56 v4,105.81
N$14  (via drill 0.35)
  Top 0.152: IC2.14 22.06,106.95 23.28,106.95 IC2.13 23.28,107.03 23.28,107.41 25.34,109.47 v33.72,109.47
  Bottom 0.152: v33.72,109.47 39.66,109.47 50.1,99.03 53.22,99.03 TRIG4.TIP
N$15
  Top 0.152: R14.2 24.19,21.15 27.24,21.15 30.14,18.26 BUT3.K
N$16
  Top 0.152: 41.72,11.93 40.58,10.79 R20.2 | 41.72,11.93 42.18,12.39 44.39,12.39 T2_RESET.B | 41.72,11.93 38.67,14.98 R19.1
N$17
  Top 0.152: 21.18,13.57 20.31,12.69 R17.2 | 21.18,13.57 22.59,14.98 22.59,15.51 T1_CLOCK.B | 21.18,13.57 17.11,17.64 15.43,17.64 14.44,16.65 R16.1
N$18  (via drill 0.35)
  Top 0.152: v43.85,14.98 40.58,14.98 R19.2
  Bottom 0.152: v43.85,14.98 50.71,14.98 54.67,11.02 RESET.TIP
N$26
  Top 0.152: R16.2 16.27,16.58 16.12,16.58 10.55,11.02 6.9,11.02 START.TIP
N$36  (via drill 0.35)
  Top 0.152: U1.14 34.63,107.18 35.77,107.18 U1.13 35.85,107.1 v35.85,103.6 | v51.17,88.28 51.17,81.65 58.25,74.57 CV2.TIP
  Bottom 0.152: v51.17,88.28 v35.85,103.6
RESET
  Top 0.152: T2_RESET.C 45.38,14.67 45.38,14.83 42.02,18.18 39.58,18.18 38.59,19.17 R18.1 38.52,19.25 38.52,24.35 35.62,27.25 35.62,42.41 37.15,43.93 37.15,44.54 U$1.P$34
RST_DISP  (via drill 0.35)
  Top 0.152: v12.38,108.48 13.52,107.33 14.59,107.33 15.43,106.49 15.43,104.89 14.44,103.9 14.44,102 R21.1
  Bottom 0.152: v12.38,108.48 12.38,108.63 22.14,118.38 29.07,118.38 30.14,117.31 DISPLAY.5 30.14,117.24 29.83,116.93 29.83,80.97 21.98,73.12 21.98,72.51 U$1.P$3
RX
  Bottom 0.152: U$1.P$6 21.98,64.81 21.98,64.2 33.18,53 33.18,25.49 PROGRAM.5
SCK  (via drill 0.35)
  Top 0.152: 17.41,90.26 23.58,90.26 24.42,91.1 24.42,91.64 U2.4 | 17.41,90.26 16.57,90.26 14.36,92.47 14.21,92.47 R24.1 14.06,92.55 14.06,93.31 4.76,102.61 4.76,118.92 5.98,120.13 31.36,120.13 34.17,117.31 35.17,117.31 DISPLAY.3 | v25.26,71.14 22.97,73.42 14.29,73.42 12.91,72.05 12.15,72.05 11.85,72.36 11.85,81.58 17.41,87.14 17.41,90.26
  Bottom 0.152: v25.26,71.14 25.26,64.66 37.15,52.77 37.15,52.24 U$1.P$31
START  (via drill 0.35)
  Top 0.152: v20.61,20.77 23.58,17.8 T1_CLOCK.C | v15.73,20.77 14.44,22.07 R15.1
  Bottom 0.152: v15.73,20.77 v20.61,20.77 21.22,20.77 28.61,13.38 28.61,12.92 29.76,11.78 30.52,11.78 31.2,12.46 31.2,13.23 31.05,13.38 31.05,15.97 31.2,16.12 31.2,19.78 34.48,23.05 34.48,38.68 37.15,41.34 37.15,41.95 U$1.P$35
TRIG1  (via drill 0.35)
  Top 0.152: IC2.10 27.09,106.95 27.09,107.41 26.17,108.32 25.49,108.32 24.57,107.41 24.57,106.95 IC2.12 24.5,106.88 24.5,106.34 v22.74,104.59 | v13.07,86.45 9.26,82.64 9.26,72.51 17.03,64.74 17.03,52.62 21.91,47.74 21.91,47.13 U$1.P$13
  Bottom 0.152: v13.07,86.45 13.07,91.79 22.74,101.47 v22.74,104.59
TRIG2  (via drill 0.35)
  Top 0.152: IC2.3 24.57,101.77 24.57,102.23 25.41,103.06 26.25,103.06 27.09,102.23 27.09,101.77 IC2.5 27.16,101.69 27.16,101.16 28.38,99.94 v32.96,99.94
  Bottom 0.152: v32.96,99.94 31.13,98.11 31.13,94.53 38.75,86.91 38.75,74.64 38.21,74.11 36.84,74.11 35.62,72.89 35.62,59.4 36.16,58.87 37.53,58.87 38.75,57.65 38.75,34.03 37.22,32.5 37.22,31.89 U$1.P$39
TX
  Top 0.152: U$1.P$7 21.98,62.3 21.98,61.69 30.67,53 30.67,25.49 PROGRAM.4
VOUTA
  Top 0.152: U2.14 20.69,96.89 20.69,97.88 22.44,99.64 32.35,99.64 32.65,99.33 35.01,99.33 37.07,101.39 37.07,101.92 U1.3 37.07,102 36.54,102.53 36.54,108.32 37.07,108.86 38.9,108.86 39.58,108.17 39.58,107.18 U1.10
VOUTB  (via drill 0.35)
  Top 0.152: v25.79,98.72 25.79,96.89 U2.10 | v27.62,103.9 29.53,103.9 34.78,109.16 39.43,109.16 40.19,108.4 40.19,105.96 40.04,105.81 39.28,105.81 39.05,106.04 39.05,108.25 38.75,108.55 37.98,108.55 37.15,107.71 37.15,107.18 U1.12 37.15,107.1 37.15,106.42 39.58,103.98 39.58,102 U1.5
  Bottom 0.152: v25.79,98.72 25.79,102.08 v27.62,103.9

### Text on the board
Bottom: A Mineral Fire | Trig 2a | Trig 1a | Trig 2b | Trig 1b | CV2 | CV1 | Length | Length | Tempo | Tempo | Start | Start | Reset
bNames: Sequencer / Design Andy C | CC BY 3.0 | V1.0
bStop: A Mineral Fire | Trig 2a | Trig 1a | Trig 2b | Trig 1b | CV2 | CV1 | Length | Tempo | Start | Start | Start | Reset